# Altium schematic sheet CuC_ControlComm.SchDoc: CuC Control Comm
size A4; Author: eldar6776@hotmail.com; DrawnBy: Eldar Dedić; Organization: PROVEN d.o.o.; Address1: Adema Buće 102; Address2: 71000 Sarajevo; Address3: Federacija BiH; Address4: Bosna i Hercegovina; DocumentNumber: DE211213; Revision: 001; SheetNumber: 7; SheetTotal: 15; ProjectName: MIKSER SIROVINE
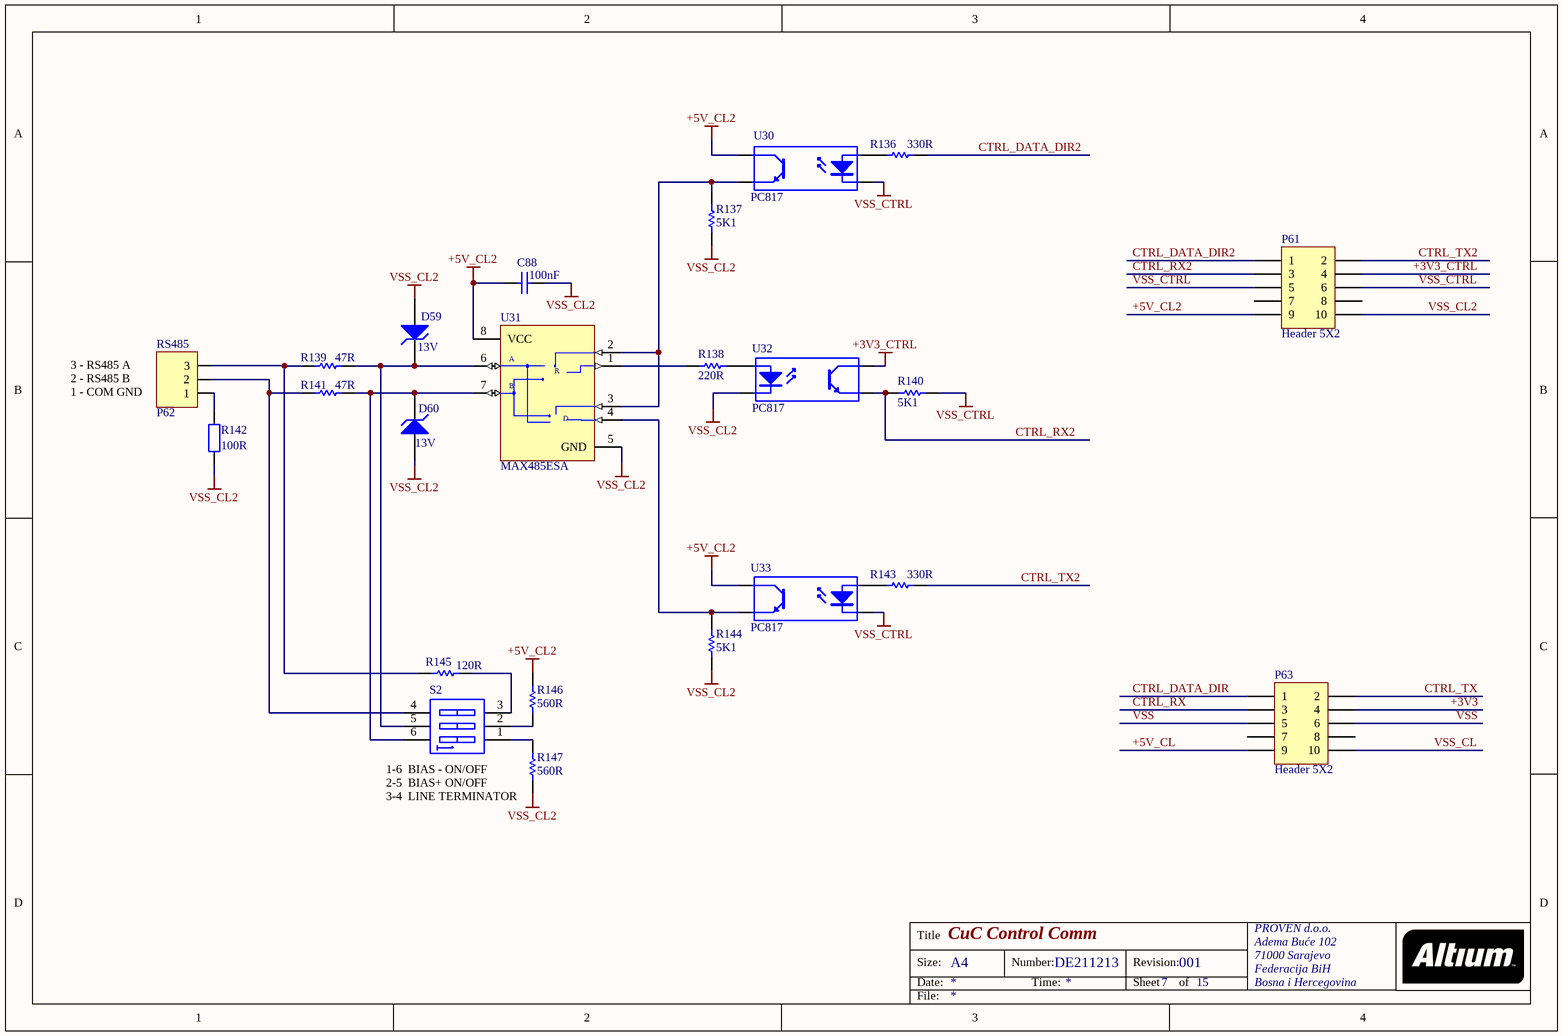
[diagram p0: CuC_ControlComm.SchDoc]

## Parts
C88  100nF  [1206]
D59  13V  [DO-35A]
D60  13V  [DO-35A]
P61  Header 5X2  [HDR2X5]
P62  RS485  [TERMINAL BLOK 3]
P63  Header 5X2  [HDR2X5]
R136  330R  [ERA-0805]
R137  5K1  [8-1206]
R138  220R  [ERA-0805]
R139  47R  [ERA-0805]
R140  5K1  [8-1206]
R141  47R  [ERA-0805]
R142  100R  [AXIAL-0.4]
R143  330R  [ERA-0805]
R144  5K1  [8-1206]
R145  120R  [ERA-0805]
R146  560R  [ERA-0805]
R147  560R  [ERA-0805]
S2  (no value)  [DIP-6]
U30  PC817  [DIP-4]
U31  MAX485ESA  [NSO8_N]
U32  PC817  [DIP-4]
U33  PC817  [DIP-4]

## Nets
+3V3_CTRL: P61.4 U32.4(C)
+5V_CL2: C88.2 P61.9 R146.2 U30.4(C) U31.8(VCC) U33.4(C)
VSS_CL2: C88.1 D59.1(A) D60.1(A) P61.10 R137.1 R142.1 R144.1 R147.1 U31.5(GND) U32.2(K)
VSS_CTRL: P61.5 P61.6 R140.2 U30.2(K) U33.2(K)
+3V3: P63.4
+5V_CL: P63.9
CTRL_DATA_DIR: P63.1
CTRL_DATA_DIR2: P61.1 R136.2
CTRL_RX: P63.3
CTRL_RX2: P61.3 R140.1 U32.3(E)
CTRL_TX: P63.2
CTRL_TX2: P61.2 R143.2
VSS: P63.5 P63.6
VSS_CL: P63.10
NetD59_2: D59.2(K) R139.2 S2.5(B2) U31.6(A)
NetD60_2: D60.2(K) R141.2 S2.6(B1) U31.7(B)
NetP62_1: P62.1 R142.2
NetP62_2: P62.2 R141.1 S2.4(B3)
NetP62_3: P62.3 R139.1 R145.1
NetR136_1: R136.1 U30.1(A)
NetR137_2: R137.2 U30.3(E) U31.2(~{RE}) U31.3(DE)
NetR138_1: R138.1 U32.1(A)
NetR138_2: R138.2 U31.1(RO)
NetR143_1: R143.1 U33.1(A)
NetR144_2: R144.2 U31.4(DI) U33.3(E)
NetR145_2: R145.2 S2.3(A3)
NetR146_1: R146.1 S2.2(A2)
NetR147_2: R147.2 S2.1(A1)

Not connected (* = marked no-connect by the designer): P61 7 8; P63 7 8

## Notes on the sheet
- 3 - RS485 A
  2 - RS485 B
  1 - COM GND
- (near R147) 1-6  BIAS - ON/OFF
  2-5  BIAS+ ON/OFF
  3-4  LINE TERMINATOR
- Title
- Size:
- Date:
- A4
- Number:
- Time:
- Revision:
- Sheet
- of
- File:
- (in symbol MAX485ESA) R; D

## Library data of the parts
C88 = C1206: Ceramic Chip Capacitor - Standard; Published: 17-Jul-2002; LatestRevisionDate: 19-Mar-2004; LatestRevisionNote: Silkscreen size reduced.; DatasheetDocument: Mar-2001; PackageDocument: Mar-2001; PackageReference: 1206; Publisher: Altium Limited; Code_JEITA: 1206; Code_IPC: 3216 [1206]; ComponentLink1Description: Manufacturer Link; ComponentLink1URL: http://www.kemet.com/; ComponentLink2Description: Datasheet; ComponentLink2URL: http://www.kemet.com/kemet/web/homepage/kechome.nsf/vapubfilesname/F3102TA.pdf/$file/F3102TA.pdf
D59 D60 = D Zener: Zener Diode; Published: 8-Jun-2000; LatestRevisionDate: 17-Jul-2002; LatestRevisionNote: Re-released for DXP Platform.; PackageReference: DIODE-0.7; Publisher: Altium Limited; PackageDescription: Diode, Thru-Hole; 2 Leads; 0.7 in Pin Spacing
P61 P63 = Header 5X2: Header, 5-Pin, Dual row; LatestRevisionDate: 17-Jul-2002; LatestRevisionNote: Re-released for DXP Platform.; Publisher: Altium Limited
P62 = TERMINAL BLOK 3: 3 pinski terminal blok konektor
R136 R143 = ERA6Y: Rectangular Thick Film Chip Resistor, 10 Ohm to 1M Ohm Range, 0.1% and 0.5% Tolerance, 0805 Size, 0.1 W; Note: If flow soldering, adjust pad width of PCB Footprint to 0.7 - 0.8 times the width of the resistor.; Published: 17-Dec-2003; LatestRevisionDate: 19-Mar-2004; LatestRevisionNote: Silkscreen size reduced.; PackageDocument: Mar-2003; PackageReference: ERA-0805; Publisher: Altium Limited; Code_IPC: 2012 [0805]; ComponentLink1Description: Manufacturer Link; ComponentLink1URL: http://www.panasonic.com/industrial/components/resistive_products.htm; ComponentLink2Description: Datasheet; ComponentLink2URL: http://www.panasonic.com/industrial/components/pdf/AOA0000CE8.pdf
R137 R140 R144 = ERJ8GE: Thick Film Chip Resistor, 1 Ohm to 10M Ohm Range, 5% Tolerance, 1206 Size, 0.25 W; Note: If flow soldering, adjust pad width of PCB Footprint to 0.7 - 0.8 times the width of the resistor.; Published: 17-Dec-2003; LatestRevisionDate: 19-Mar-2004; LatestRevisionNote: Silkscreen size reduced.; PackageDocument: Mar-2003; PackageReference: 8-1206; Publisher: Altium Limited; Code_IPC: 3216 [1206]; ComponentLink1Description: Manufacturer Link; ComponentLink1URL: http://www.panasonic.com/industrial/components/resistive_products.htm; ComponentLink2Description: Datasheet; ComponentLink2URL: http://www.panasonic.com/industrial/components/pdf/AOA0000CE1.pdf
R138 R139 R141 R145-R147 = ERAS: Metal Film Thermosensitive Chip Resistor, 0.56 Ohm to 10k Ohm Range, 5% Tolerance, 0805 Size, 0.1 W; Note: If flow soldering, adjust pad width of PCB Footprint to 0.7 - 0.8 times the width of the resistor.; Published: 17-Dec-2003; LatestRevisionDate: 19-Mar-2004; LatestRevisionNote: Silkscreen size reduced.; PackageDocument: Mar-2003; PackageReference: ERA-0805; Publisher: Altium Limited; Code_IPC: 2012 [0805]; ComponentLink1Description: Manufacturer Link; ComponentLink1URL: http://www.panasonic.com/industrial/components/resistive_products.htm; ComponentLink2Description: Datasheet; ComponentLink2URL: http://www.panasonic.com/industrial/components/pdf/AOF0000CE1.pdf
R142 = Res2: Resistor; Published: 8-Jun-2000; LatestRevisionDate: 17-Jul-2002; LatestRevisionNote: Re-released for DXP Platform.; PackageReference: AXIAL-0.4; Publisher: Altium Limited; PackageDescription: Axial Device, Thru-Hole; 2 Leads; 0.4 in Pin Spacing
S2 = SW DIP-3: DIP Switch, 3 Position, SPST; Published: 24-Mar-1999; LatestRevisionDate: 17-Jul-2002; LatestRevisionNote: Re-released for DXP Platform.; PackageReference: DIP-6; Publisher: Altium Limited; Code_JEDEC: MO-001-AM
U30 U32 U33 = Optoisolator1: 4-Pin Phototransistor Optocoupler; Published: 24-Mar-1999; LatestRevisionDate: 04-Mar-2005; LatestRevisionNote: Sch pins 3 & 4 Swapped.; DatasheetVersion: Nov-2003; PackageReference: DIP-4; Publisher: Altium Limited
U31 = MAX485ESA: Low-Power, Slew-Rate-Limited RS-485/RS-422 Transceiver; Published: 16-Jan-2001; LatestRevisionDate: 13-Apr-2006; LatestRevisionNote: IPC-7351 Footprint Added.; DatasheetVersion: Feb-1996; PackageReference: NSO8; Publisher: Altium Limited; PackageDescription: 8-Pin Small Outline Integrated Circuit 1.27 mm Pitch; Code_JEDEC: MS-012-AA; Code_IPC: SOIC127P600-8; ComponentLink1Description: Manufacturer Link; ComponentLink1URL: http://www.maxim-ic.com/; ComponentLink2Description: Datasheet; ComponentLink2URL: http://pdfserv.maxim-ic.com/en/ds/MAX1487-MAX491.pdf